# EAGLE schematic SKAARDUINO-POE_v1.0 (EAGLE 7.5.0)

## Sheet 1 of 2
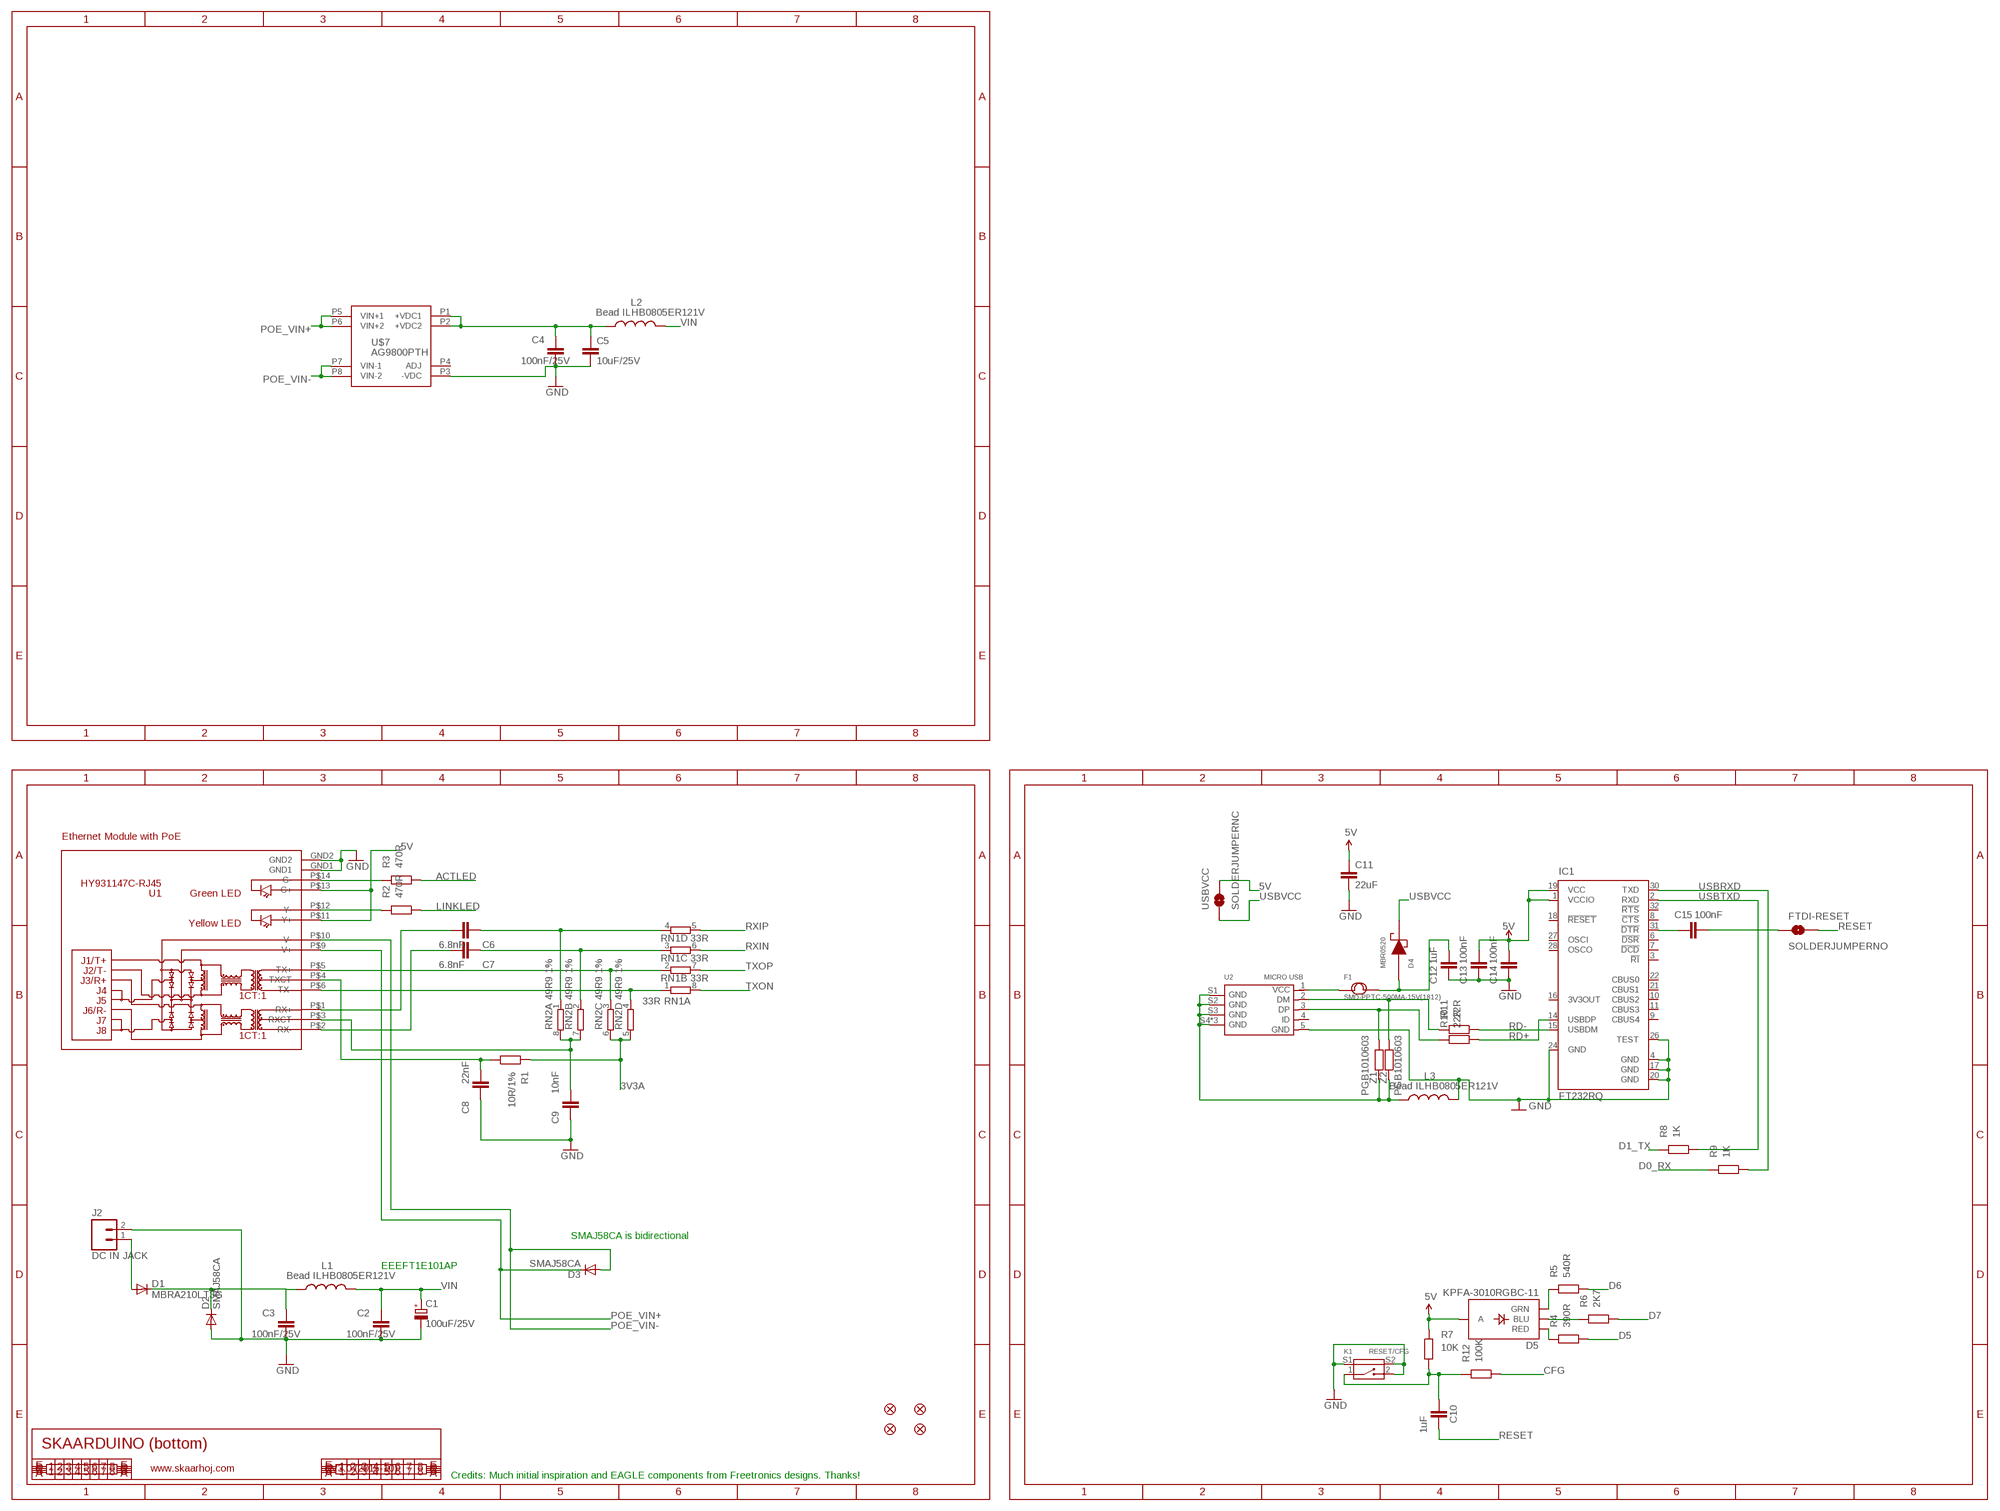
[diagram p0: schematic, sheet 1]

### Parts
C1  100uF/25V  CPOL-EUD  [PANASONIC_D]
C2  100nF/25V  CAP0402  [C0402]
C3  100nF/25V  CAP0402  [C0402]
C4  100nF/25V  CAP0402  [C0402]
C5  10uF/25V  CAP0805  [0805]
C6  6.8nF  C-EU0402C  [0402C]
C7  6.8nF  C-EU0402C  [0402C]
C8  22nF  C-EU0402C  [0402C]
C9  10nF  C-EU0402C  [0402C]
C10  1uF  C-EU0402C  [0402C]
C11  22uF  CAP0805  [0805]
C12  1uF  C-EU0402C  [0402C]
C13  100nF  C-EU0402C  [0402C]
C14  100nF  C-EU0402C  [0402C]
C15  100nF  C-EU0402C  [0402C]
D1  MBRA210LT3G  DIODESMA  [SMA-DIODE]
D2  SMAJ58CA  DIODESMA  [SMA-DIODE]
D3  SMAJ58CA  DIODESMA  [SMA-DIODE]
D4  MBR0520  [SOD-123]
D5  KPFA-3010RGBC-11  LED-TRICOLOR  [LED-TRICOLOR-SMD]
F1  SMD-PPTC-500MA-15V(1812)  [F1812]
FID1  FIDUCIAL1X2.5  [FIDUCIAL-1X2.5]
FID2  FIDUCIAL1X2.5  [FIDUCIAL-1X2.5]
FID3  FIDUCIAL1X2.5  [FIDUCIAL-1X2.5]
FID4  FIDUCIAL1X2.5  [FIDUCIAL-1X2.5]
FTDI-RESET  SOLDERJUMPERNO  [SJ_2S-NO]
IC1  FT232RQ  [QFN32]
J2  DC IN JACK  M02PTH  [1X02]
K1  RESET/CFG  SMD-BUTTON-2+2P  [SW4-SMD-7.0X3.5X3.5MM-90D]
L1  Bead ILHB0805ER121V  L-USL2012C  [L2012C]
L2  Bead ILHB0805ER121V  L-USL2012C  [L2012C]
L3  Bead ILHB0805ER121V  L-USL2012C  [L2012C]
R1  10R/1%  RESISTOR0402  [0402]
R2  470R  RESISTOR0402  [0402]
R3  470R  RESISTOR0402  [0402]
R4  390R  RESISTOR0402  [0402]
R5  540R  RESISTOR0402  [0402]
R6  2K7  RESISTOR0402  [0402]
R7  10K  RESISTOR0402  [0402]
R8  1K  RESISTOR0402  [0402]
R9  1K  RESISTOR0402  [0402]
R10  22R  RESISTOR0402  [0402]
R11  22R  RESISTOR0402  [0402]
R12  100K  RESISTOR0402  [0402]
RN1  33R  4R-NCAY16  [CAY16]
RN2  49R9 1%  4R-NCAY16  [CAY16]
U1  HY931147C-RJ45  [HY931147C]
U2  MICRO USB  MICRO-USB-SMD-B-WITHOUT-POST-W/P(ST-USB-001G)  [MICRO-USB5+4P-SMD-0.65-B]
U$7  AG9800PTH  [AG9800PTH]
USBVCC  SOLDERJUMPERNC  [SJ_2S]
Z1  PGB1010603  RESISTOR0402  [C0402]
Z2  PGB1010603  RESISTOR0402  [C0402]

### Nets
3V3A: R1.2 RN2.5 RN2.6 ; also sheet 2
5V [power]: C11.1 C13.2 C14.2 D5.A IC1.1(VCCIO) IC1.19(VCC) R7.2 U1.P$11(Y+) U1.P$13(G+) USBVCC.2 ; also sheet 2
ACTLED: R3.1 ; also sheet 2
CFG: R12.1 ; also sheet 2
CFGSW: C10.2 K1.1 R7.1 R12.2
D0_RX: R9.2 ; also sheet 2
D1_TX: R8.2 ; also sheet 2
D5: R4.1 ; also sheet 2
D6: R5.1 ; also sheet 2
D7: R6.1 ; also sheet 2
GND [power]: C1.- C2.2 C3.2 C4.2 C5.2 C8.1 C9.1 C11.2 C12.1 C13.1 C14.1 D2.A IC1.4(GND) IC1.17(GND) IC1.20(GND) IC1.24(GND) IC1.26(TEST) J2.2 K1.2 K1.S1 K1.S2 L3.2 U1.GND1 U1.GND2 U2.5(GND) U$7.P3(-VDC) ; also sheet 2
LINKLED: R2.1 ; also sheet 2
N$1: C8.2 R1.1 U1.P$4(TXCT)
N$2: C15.2 FTDI-RESET.1
N$3: D5.B(BLU) R6.2
N$4 [VIN]: C3.1 D1.C D2.C L1.1
N$5: D5.G(GRN) R5.2
N$6 [VIN]: C12.2 D4.2(AN) F1.2
N$7 [VIN]: F1.1 U2.1(VCC)
N$9: C7.2 U1.P$2(RX-)
N$11: C6.2 U1.P$1(RX+)
N$13 [VIN]: D1.A J2.1
N$15: D5.R(RED) R4.2
N$16: R10.2 U2.3(DP) Z1.1
N$17: R11.2 U2.2(DM) Z2.1
N$18: C15.1 IC1.31(!DTR)
N$21: L3.1 U2.S1(GND) U2.S2(GND) U2.S3(GND) U2.S4(GND) U2.S5(GND) U2.S6(GND) Z1.2 Z2.2
N$67: R3.2 U1.P$14(G-)
N$321: C9.2 RN2.7 RN2.8 U1.P$3(RXCT)
N$332: R2.2 U1.P$12(Y-)
POE_DC_RETURN [VIN]: C4.1 C5.1 L2.1 U$7.P1(+VDC1) U$7.P2(+VDC2)
POE_VIN+ [VIN]: D3.C U1.P$9(V+) U$7.P5(VIN+1) U$7.P6(VIN+2)
POE_VIN- [VIN]: D3.A U1.P$10(V-) U$7.P7(VIN-1) U$7.P8(VIN-2)
RD+: IC1.14(USBDP) R10.1
RD-: IC1.15(USBDM) R11.1
RESET: C10.1 FTDI-RESET.2 ; also sheet 2
RXIN: RN1.6 ; also sheet 2
RXIN_E: C7.1 RN1.3 RN2.2
RXIP: RN1.5 ; also sheet 2
RXIP_E: C6.1 RN1.4 RN2.1
TXON: RN1.8 ; also sheet 2
TXON_E: RN1.1 RN2.4 U1.P$6(TX-)
TXOP: RN1.7 ; also sheet 2
TXOP_E: RN1.2 RN2.3 U1.P$5(TX+)
USBRXD: IC1.30(TXD) R9.1
USBTXD: IC1.2(RXD) R8.1
USBVCC [VIN]: D4.1(CA) USBVCC.1
VIN [VIN]: C1.+ C2.1 L1.2 L2.2 ; also sheet 2
Unconnected: IC1.3(!RI) IC1.6(!DSR) IC1.7(!DCD) IC1.8(!CTS) IC1.9(CBUS4) IC1.10(CBUS2) IC1.11(CBUS3) IC1.16(3V3OUT) IC1.18(!RESET) IC1.21(CBUS1) IC1.22(CBUS0) IC1.27(OSCI) IC1.28(OSCO) IC1.32(!RTS) U2.4(ID) U$7.P4(ADJ)

### Notes on the sheet
- Ethernet Module with PoE
- SMAJ58CA is bidirectional
- EEEFT1E101AP
- SKAARDUINO (bottom)
- www.skaarhoj.com | V3.0 (2015-10)
- Credits: Much initial inspiration and EAGLE components from Freetronics designs. Thanks!

## Sheet 2 of 2
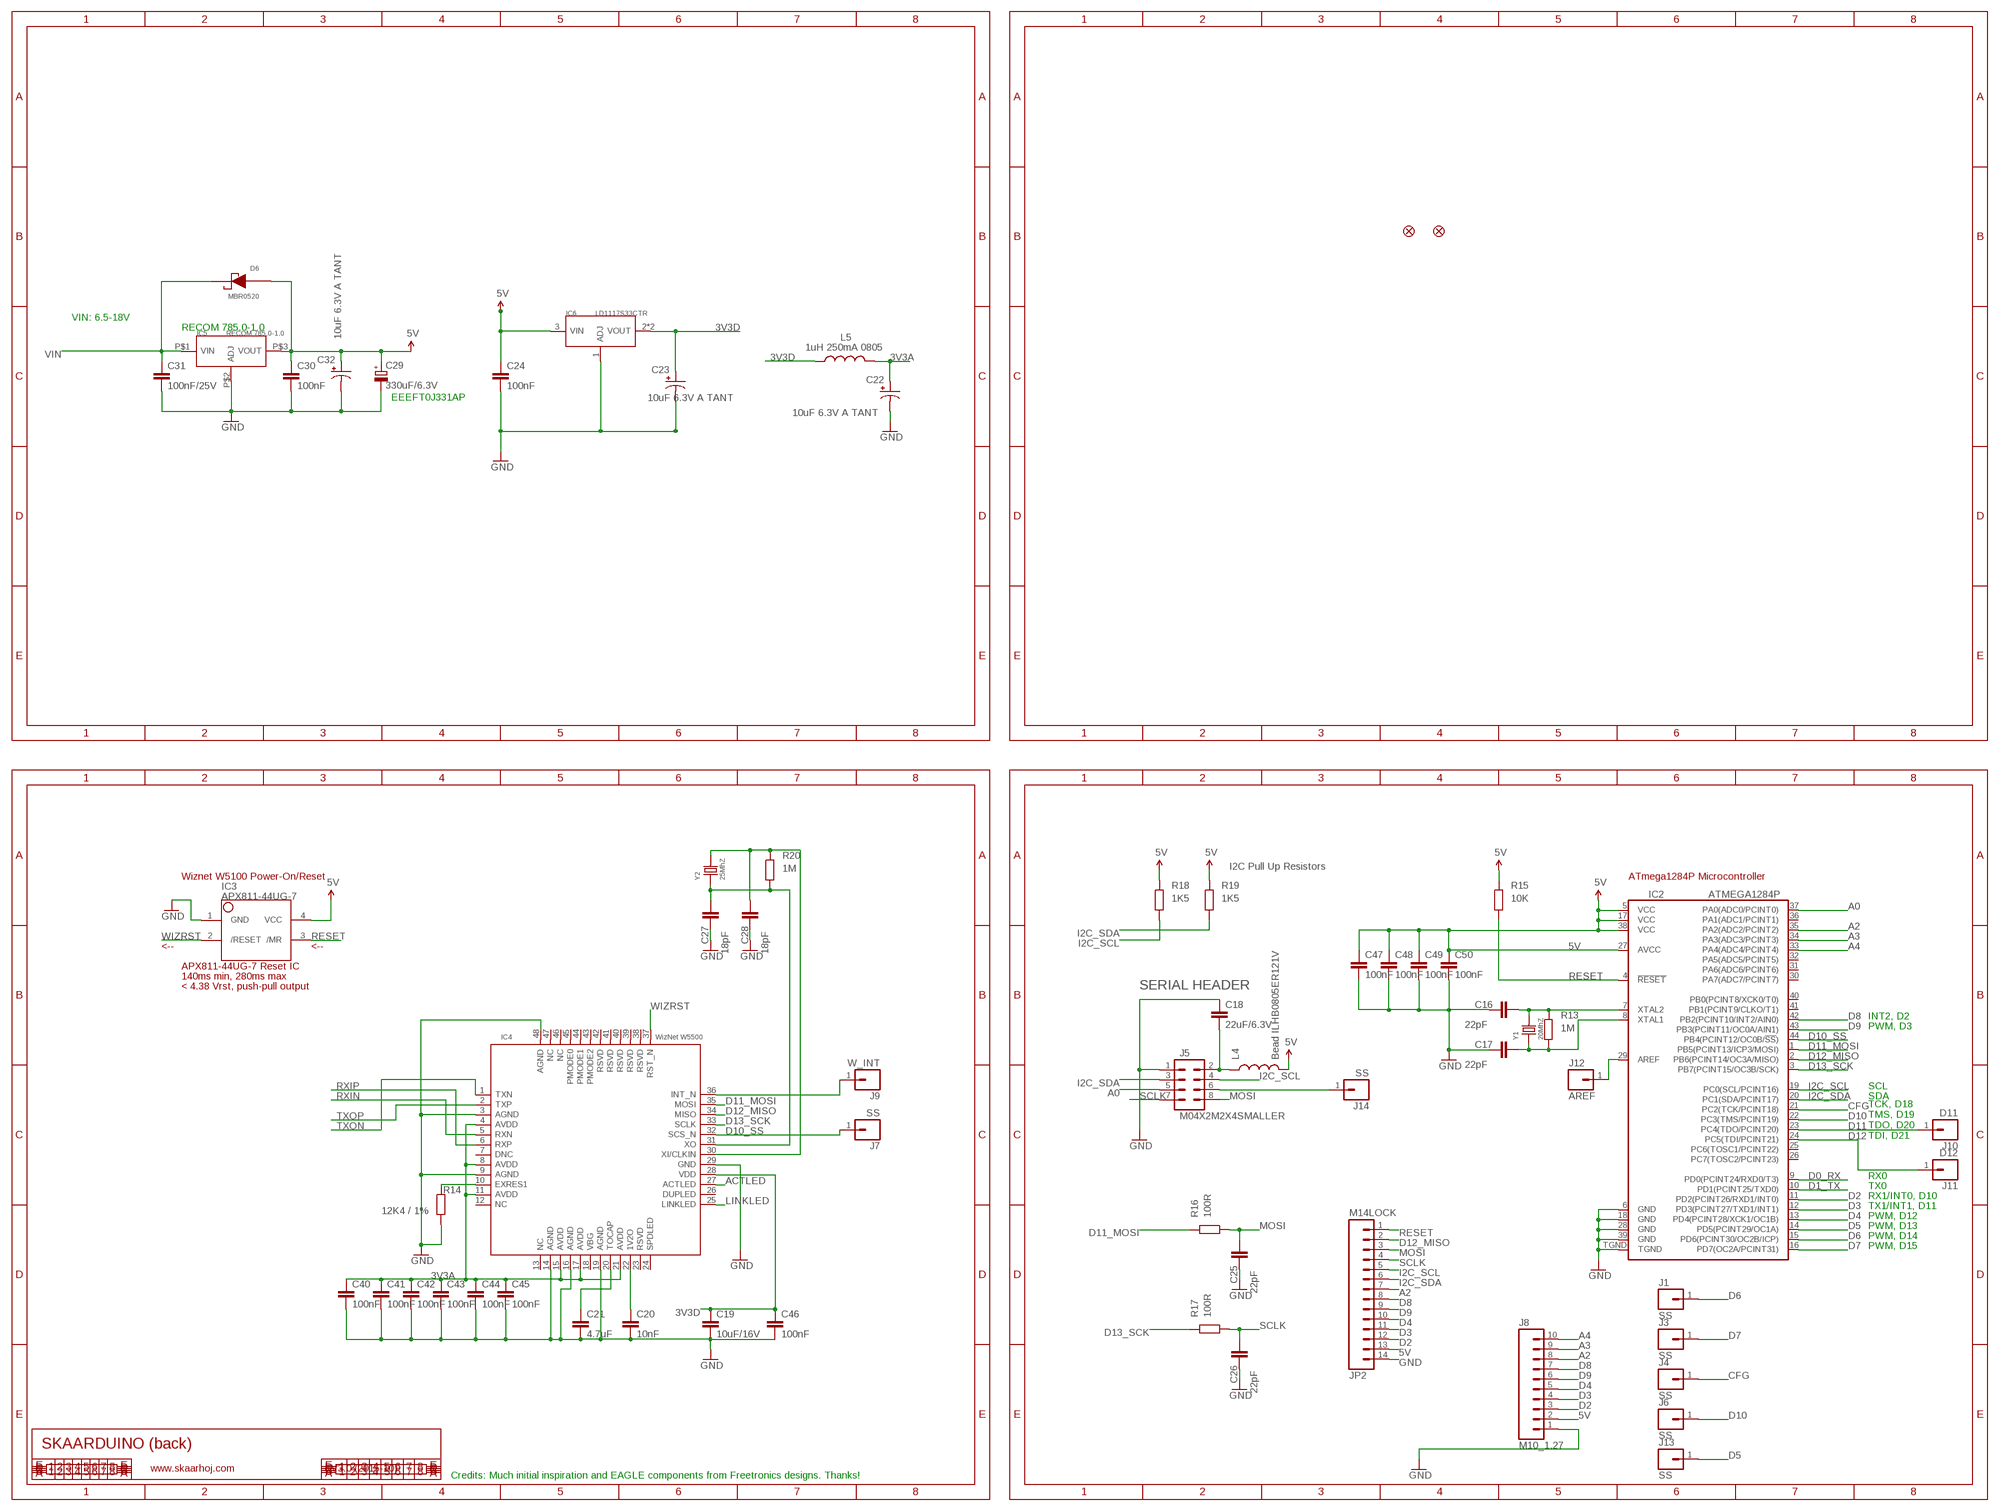
[diagram p1: schematic, sheet 2]

### Parts
C16  22pF  C-EU0402C  [0402C]
C17  22pF  C-EU0402C  [0402C]
C18  22uF/6.3V  CAP0805  [0805]
C19  10uF/16V  CAP0805  [0805]
C20  10nF  C-EU0402C  [0402C]
C21  4.7uF  CAP0805  [0805]
C22  10uF 6.3V A TANT  CAP_POL1206  [EIA3216]
C23  10uF 6.3V A TANT  CAP_POL1206  [EIA3216]
C24  100nF  C-EU0402C  [0402C]
C25  22pF  C-EU0402C  [0402C]
C26  22pF  C-EU0402C  [0402C]
C27  18pF  C-EU0402C  [0402C]
C28  18pF  C-EU0402C  [0402C]
C29  330uF/6.3V  CPOL-EUD  [PANASONIC_D]
C30  100nF  C-EU0402C  [0402C]
C31  100nF/25V  C-EU0402C  [0402C]
C32  10uF 6.3V A TANT  CAP_POL1206  [EIA3216]
C40  100nF  C-EU0402C  [0402C]
C41  100nF  C-EU0402C  [0402C]
C42  100nF  C-EU0402C  [0402C]
C43  100nF  C-EU0402C  [0402C]
C44  100nF  C-EU0402C  [0402C]
C45  100nF  C-EU0402C  [0402C]
C46  100nF  C-EU0402C  [0402C]
C47  100nF  C-EU0402C  [0402C]
C48  100nF  C-EU0402C  [0402C]
C49  100nF  C-EU0402C  [0402C]
C50  100nF  C-EU0402C  [0402C]
D6  MBR0520  [SOD-123]
FID5  FIDUCIAL1X2.5  [FIDUCIAL-1X2.5]
FID8  FIDUCIAL1X2.5  [FIDUCIAL-1X2.5]
IC2  ATMEGA1284P  [QFN-44M1]
IC3  APX811-44UG-7  APX81X-RESET-IC  [SOT143-R]
IC4  WizNet W5500  DRIVER-W5500  [LQFP-48]
IC5  RECOM 785.0-1.0  PMIC-LM317EMP  [RECOM_785.0-1.0]
IC6  LD1117S33CTR  PMIC-LM317EMP-310030006  [SOT-223]
J1  SS  M1X1TEST  [M1X1]
J3  SS  M1X1TEST  [M1X1]
J4  SS  M1X1TEST  [M1X1]
J5  M04X2M2X4SMALLER  [M2X4SMALLER]
J6  SS  M1X1TEST  [M1X1]
J7  SS  M1X1TEST  [M1X1]
J8  M10_1.27  [M10X1]
J9  W_INT  M1X1TEST  [M1X1]
J10  D11  M1X1TEST  [M1X1]
J11  D12  M1X1TEST  [M1X1]
J12  AREF  M1X1TEST  [M1X1]
J13  SS  M1X1TEST  [M1X1]
J14  SS  M1X1TEST  [M1X1]
JP2  M14LOCK  [1X14_LOCK]
L4  Bead ILHB0805ER121V  INDUCTOR0805  [0805]
L5  1uH 250mA 0805  L-USL2012C  [L2012C]
R13  1M  RESISTOR0402  [0402]
R14  12K4 / 1%  RESISTOR0402  [0402]
R15  10K  RESISTOR0402  [0402]
R16  100R  RESISTOR0402  [0402]
R17  100R  RESISTOR0402  [0402]
R18  1K5  RESISTOR0402  [0402]
R19  1K5  RESISTOR0402  [0402]
R20  1M  RESISTOR0402  [0402]
Y1  20MhZ  SMD-CRYSTAL-16MHZ-8PF-20PPM-40R(2P-5.0X3.2MM)  [X2-SMD-5.0X3.2X1.3MM]
Y2  25MhZ  SMD-CRYSTAL-16MHZ-8PF-20PPM-40R(2P-5.0X3.2MM)  [X2-SMD-5.0X3.2X1.3MM]

### Nets
3V3A: C22.A(+) C40.1 C41.1 C42.1 C43.1 C44.1 C45.1 IC4.4(AVDD) IC4.8(AVDD) IC4.11(AVDD) IC4.15(AVDD) IC4.17(AVDD) IC4.21(AVDD) L5.2 ; also sheet 1
3V3D [power]: C19.1 C23.A(+) C46.1 IC4.28(VDD) IC6.2(VOUT) IC6.TER(VOUT) L5.1
5V [power]: C24.1 C29.+ C30.1 C32.A(+) C47.1 C48.1 C49.1 C50.1 D6.2(AN) IC2.5(VCC) IC2.17(VCC) IC2.27(AVCC) IC2.38(VCC) IC3.4(VCC) IC5.P$3(VOUT) IC6.3(VIN) J8.2 JP2.13 L4.2 R15.2 R18.2 R19.2 ; also sheet 1
A0: IC2.37(PA0(ADC0/PCINT0)) J5.5
A2: IC2.35(PA2(ADC2/PCINT2)) J8.8 JP2.7
A3: IC2.34(PA3(ADC3/PCINT3)) J8.9
A4: IC2.33(PA4(ADC4/PCINT4)) J8.10
ACTLED: IC4.27(ACTLED) ; also sheet 1
CFG: IC2.21(PC2(TCK/PCINT18)) J4.1 ; also sheet 1
D0_RX: IC2.9(PD0(PCINT24/RXD0/T3)) ; also sheet 1
D1_TX: IC2.10(PD1(PCINT25/TXD0)) ; also sheet 1
D2: IC2.11(PD2(PCINT26/RXD1/INT0)) J8.3 JP2.12
D3: IC2.12(PD3(PCINT27/TXD1/INT1)) J8.4 JP2.11
D4: IC2.13(PD4(PCINT28/XCK1/OC1B)) J8.5 JP2.10
D5: IC2.14(PD5(PCINT29/OC1A)) J13.1 ; also sheet 1
D6: IC2.15(PD6(PCINT30/OC2B/ICP)) J1.1 ; also sheet 1
D7: IC2.16(PD7(OC2A/PCINT31)) J3.1 ; also sheet 1
D8: IC2.42(PB2(PCINT10/INT2/AIN0)) J8.7 JP2.8
D9: IC2.43(PB3(PCINT11/OC0A/AIN1)) J8.6 JP2.9
D10: IC2.22(PC3(TMS/PCINT19)) J6.1
D10_SS: IC2.44(PB4(PCINT12/OC0B/!SS!)) IC4.32(SCS_N) J7.1
D11: IC2.23(PC4(TDO/PCINT20)) J10.1
D11_MOSI: IC2.1(PB5(PCINT13/ICP3/MOSI)) IC4.35(MOSI) R16.2
D12: IC2.24(PC5(TDI/PCINT21)) J11.1
D12_MISO: IC2.2(PB6(PCINT14/OC3A/MISO)) IC4.34(MISO) JP2.2
D13_SCK: IC2.3(PB7(PCINT15/OC3B/SCK)) IC4.33(SCLK) R17.2
GND [power]: C16.1 C17.1 C18.1 C19.2 C20.2 C21.2 C22.C(-) C23.C(-) C24.2 C25.1 C26.1 C27.1 C28.1 C29.- C30.2 C31.2 C32.C(-) C40.2 C41.2 C42.2 C43.2 C44.2 C45.2 C46.2 C47.2 C48.2 C49.2 C50.2 IC2.6(GND) IC2.18(GND) IC2.28(GND) IC2.39(GND) IC2.TGND IC3.1(GND) IC4.3(AGND) IC4.9(AGND) IC4.14(AGND) IC4.16(AGND) IC4.19(AGND) IC4.29(GND) IC4.48(AGND) IC5.P$2(ADJ) IC6.1(ADJ) J5.1 J8.1 JP2.14 R14.1 ; also sheet 1
I2C_SCL: IC2.19(PC0(SCL/PCINT16)) J5.4 JP2.5 R18.1
I2C_SDA: IC2.20(PC1(SDA/PCINT17)) J5.3 JP2.6 R19.1
LINKLED: IC4.25(LINKLED) ; also sheet 1
MOSI: C25.2 J5.8 JP2.3 R16.1
N$8: C16.2 IC2.7(XTAL2) R13.2 Y1.2
N$10: J5.6 J14.1
N$12: C17.2 IC2.8(XTAL1) R13.1 Y1.1
N$19 [power]: C18.2 J5.2 L4.1
N$20: C21.1 IC4.20(TOCAP)
N$22: C20.1 IC4.22(1V2O)
N$23: IC4.10(EXRES1) R14.2
N$24: IC4.36(INT_N) J9.1
N$25: IC2.29(AREF) J12.1
RESET: IC2.4(!RESET) IC3.3(/MR) JP2.1 R15.1 ; also sheet 1
RXIN: IC4.5(RXN) ; also sheet 1
RXIP: IC4.6(RXP) ; also sheet 1
SCLK: C26.2 J5.7 JP2.4 R17.1
TXON: IC4.1(TXN) ; also sheet 1
TXOP: IC4.2(TXP) ; also sheet 1
VIN [VIN]: C31.1 D6.1(CA) IC5.P$1(VIN) ; also sheet 1
WIZRST: IC3.2(/RESET) IC4.37(RST_N)
XTLN: C28.2 IC4.30(XI/CLKIN) R20.2 Y2.2
XTLP: C27.2 IC4.31(XO) R20.1 Y2.1
Unconnected: IC2.25(PC6(TOSC1/PCINT22)) IC2.26(PC7(TOSC2/PCINT23)) IC2.30(PA7(ADC7/PCINT7)) IC2.31(PA6(ADC6/PCINT6)) IC2.32(PA5(ADC5/PCINT5)) IC2.36(PA1(ADC1/PCINT1)) IC2.40(PB0(PCINT8/XCK0/T0)) IC2.41(PB1(PCINT9/CLKO/T1)) IC4.7(DNC) IC4.12(NC) IC4.13(NC) IC4.18(VBG) IC4.23(RSVD) IC4.24(SPDLED) IC4.26(DUPLED) IC4.38(RSVD) IC4.39(RSVD) IC4.40(RSVD) IC4.41(RSVD) IC4.42(RSVD) IC4.43(PMODE2) IC4.44(PMODE1) IC4.45(PMODE0) IC4.46(NC) IC4.47(NC)

### Notes on the sheet
- VIN: 6.5-18V
- RECOM 785.0-1.0
- EEEFT0J331AP
- I2C Pull Up Resistors
- Wiznet W5100 Power-On/Reset | ATmega1284P Microcontroller
- <-- | <--
- APX811-44UG-7 Reset IC
- 140ms min, 280ms max
- < 4.38 Vrst, push-pull output | SERIAL HEADER
- INT2, D2
- PWM, D3
- SCL
- SDA
- TCK, D18
  TMS, D19
  TDO, D20
  TDI, D21
- RX0
- TX0
- RX1/INT0, D10
- TX1/INT1, D11
- PWM, D12
- PWM, D13
- PWM, D14
- PWM, D15
- SKAARDUINO (back)
- www.skaarhoj.com | V3.0 (2015-10)
- Credits: Much initial inspiration and EAGLE components from Freetronics designs. Thanks!

## Library data of the parts
C1 C29 = rcl:CPOL-EU: POLARIZED CAPACITOR, European symbol
C2-C4 = freetronics:CAP: Capacitor Standard 0603 ceramic capacitor, and 0.1" leaded capacitor.
C5 C11 C18 C19 C21 = SparkFun:CAP: Capacitor Standard 0603 ceramic capacitor, and 0.1" leaded capacitor.
C6-C10 C12-C17 C20 C24-C28 C30 C31 C40-C50 = freetronics-jon:C-EU: CAPACITOR, European symbol
C22 C23 C32 = freetronics:CAP_POL: Capacitor Polarized These are standard SMD and PTH capacitors. Normally 10uF, 47uF, and 100uF in electrolytic and tantalum varieties. Always verify the external diameter of the through hole cap, it varies with capacity, voltage, and manufacturer. The EIA devices should be standard.
D1-D3 = SparkFun:DIODE: Diode These are standard reverse protection diodes and small signal diodes. SMA package can handle up to about 1A. SOD-323 can handle about 200mA. What the SOD-323 package when ordering, there are some mfgs out there that are 5-pin packages.
D4 D6 = MySMD:MBR0520
D5 = SKAARHOJ:LED-TRICOLOR: Tri-Color LED SMD Proven layout and schematic for triple color LED in SMD package - common anode. Spark Fun Electronics SKU : COM-07844
F1 = Seeed-OPL-fuse:SMD-PPTC-500MA-15V(1812): 307010007
FID1-FID5 FID8 = freetronics:FIDUCIAL: Fiducial Alignment Points Various fiducial points for machine vision alignment.
FTDI-RESET USBVCC = SparkFun:SOLDERJUMPER: Solder Jumper Standard SMD solder jumper. Used to automate production. Two varients : Normally Open and Normally Closed are the same, but have different paste layers. NC will have a large amount of paste and should jumper during reflow.
IC1 = ftdichip:FT232R: Source: http://www.ftdichip.com/Documents/DataSheets/DS_FT232R_v104.pdf; MPN: FT232RQ; OC_FARNELL: 1146033; OC_NEWARK: 91K9919
IC2 = freetronics-jon:ATMEGA1284P
IC3 = freetronics-master-v1:APX81X-RESET-IC
IC4 = template:DRIVER-W5500
IC5 IC6 = SKAARHOJ:PMIC-LM317EMP: 3-Terminal Adjustable Regulator
J1 J3 J4 J6 J7 J9-J14 = SKAARHOJ:M1X1
J2 = SparkFun:M02: Header 2 Standard 2-pin 0.1" header. Use with straight break away headers (SKU : PRT-00116), right angle break away headers (PRT-00553), swiss pins (PRT-00743), machine pins (PRT-00117), and female headers (PRT-00115). Molex polarized connector foot print use with SKU : PRT-08233 with associated crimp pins and housings.
J5 = SKAARHOJ:M04X2
J8 = SKAARHOJ:M10_1.27
JP2 = SKAARHOJ:M14: Header 14 Standard 14-pin 0.1" header. Use with straight break away headers (SKU : PRT-00116), right angle break away headers (PRT-00553), swiss pins (PRT-00743), machine pins (PRT-00117), and female headers (PRT-00115).
K1 = Seeed-OPL-Button:SMD-BUTTON-2+2P: 311020023; MPN: TS-1188E
L1-L3 L5 = rcl:L-US: INDUCTOR, American symbol
L4 = SparkFun:INDUCTOR: Inductors Basic Inductor/Choke - 0603 and 1206. Footprints are not proven and vary greatly between part numbers.
R1-R20 = freetronics-jon:RESISTOR: Resistor Basic schematic elements and footprints for 0603, 1206, and PTH 1/10th watt (small) resistors.
RN1 RN2 = freetronics-master-v1:4R-N: Array Chip Resistor Source: RS Component / Phycomp
U1 = freetronics-jon:HY931147C
U2 = Seeed-OPL-Connector:MICRO-USB-SMD-B-WITHOUT-POST-W/P(ST-USB-001G): 320010000; MPN: ST-USB-001G
U$7 = SKAARHOJ:AG9800
Y1 Y2 = Seeed-OPL-crystal-osctllator:SMD-CRYSTAL-16MHZ-8PF-20PPM-40R(2P-5.0X3.2MM): 306010054; MPN: X053201602002
Z1 Z2 = freetronics:RESISTOR: Resistor Basic schematic elements and footprints for 0603, 1206, and PTH 1/10th watt (small) resistors.

## Net classes
0 default: width 0.203 mm, clearance 0.127 mm
1 power: width 0.203 mm, clearance 0.127 mm
2 VIN: width 0.406 mm, clearance 0.61 mm